# Altium schematic sheet MCUPinout.SchDoc
size B; SheetNumber: 2; SheetTotal: 7
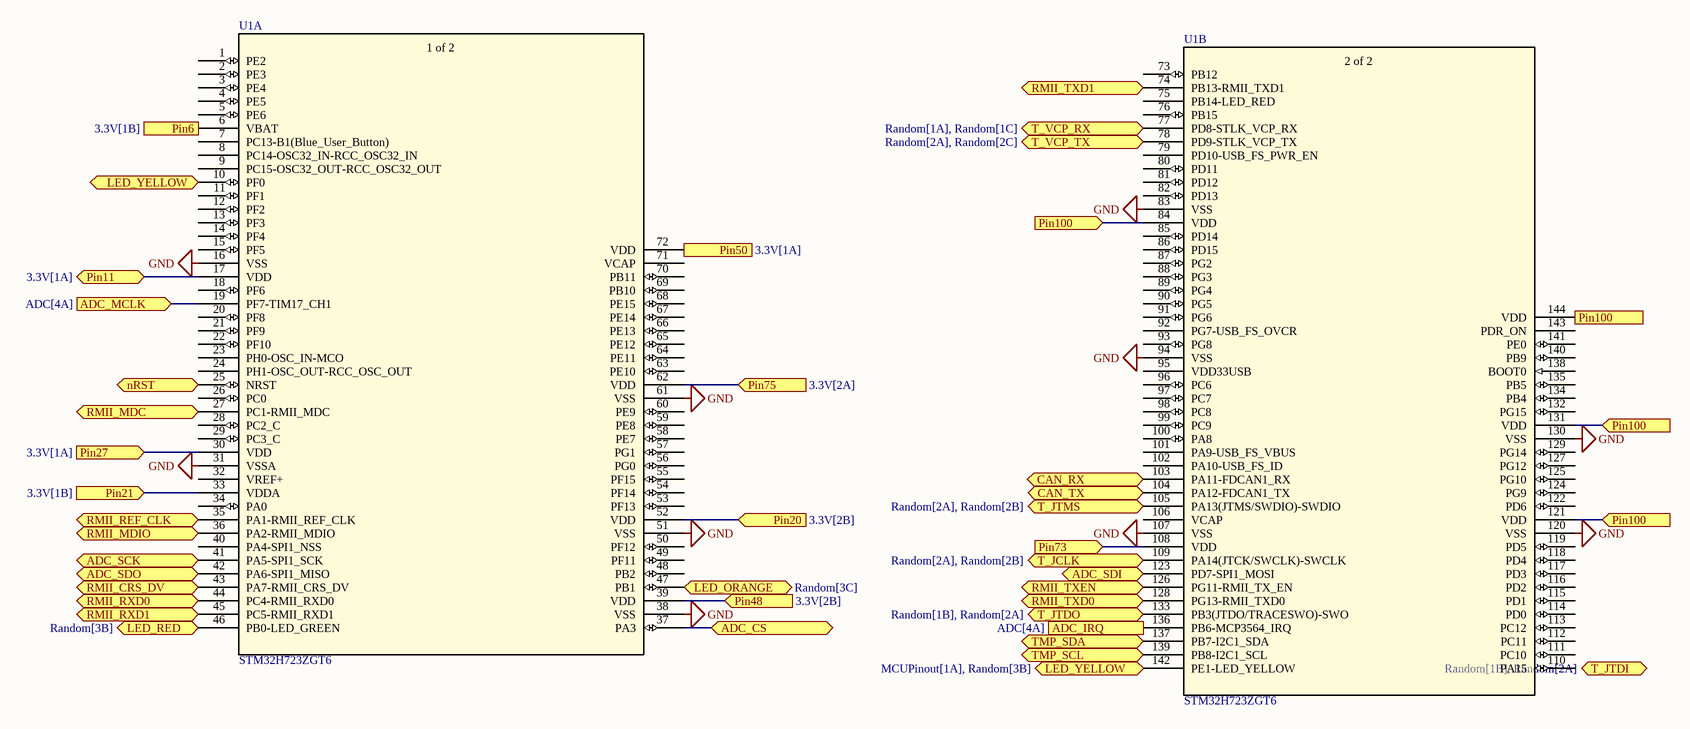
[diagram p0: MCUPinout.SchDoc]

## Parts
U1  STM32H723ZGT6  [LQFP144_STM]  (parts A,B of 2)

## Ports
ADC_CS (bidir, see ADC[4A]), ADC_IRQ (out, see ADC[4A]), ADC_MCLK (in, see ADC[4A]), ADC_SCK (bidir, see ADC[4A]), ADC_SDI (bidir, see ADC[4A]), ADC_SDO (bidir, see ADC[4A]), CAN_RX (bidir, see ADC[3C]), CAN_TX (bidir, see ADC[3C]), LED_ORANGE (bidir, see Random[3C]), LED_RED (bidir, see Random[3B]), LED_YELLOW (bidir, see MCUPinout[1A], Random[3B]), LED_YELLOW (bidir, see MCUPinout[4C], Random[3B]), nRST (bidir, see ETH[1C], Random[2A], Random[2C]), Pin6 (in, see 3.3V[1B]), Pin11 (bidir, see 3.3V[1A]), Pin20 (in, see 3.3V[2B]), Pin21 (in, see 3.3V[1B]), Pin27 (in, see 3.3V[1A]), Pin48 (in, see 3.3V[2B]), Pin50 (in, see 3.3V[1A]), Pin73 (in, see 3.3V[2B]), Pin75 (in, see 3.3V[2A]), Pin100 (in, see 3.3V[2A], MCUPinout[4A], MCUPinout[5B], MCUPinout[6B]), Pin100 (in, see 3.3V[2A], MCUPinout[4A], MCUPinout[6B]), Pin100 (in, see 3.3V[2A], MCUPinout[5B], MCUPinout[6B]), RMII_CRS_DV (bidir, see ETH[1C]), RMII_MDC (bidir, see ETH[1C]), RMII_MDIO (bidir, see ETH[1C]), RMII_REF_CLK (bidir, see ETH[3B]), RMII_RXD0 (bidir, see ETH[1B]), RMII_RXD1 (bidir, see ETH[1B]), RMII_TXD0 (bidir, see ETH[1B]), RMII_TXD1 (bidir, see ETH[1B]), RMII_TXEN (bidir, see ETH[1B]), T_JCLK (bidir, see Random[2A], Random[2B]), T_JTDI (bidir, see Random[1B], Random[2A]), T_JTDO (bidir, see Random[1B], Random[2A]), T_JTMS (bidir, see Random[2A], Random[2B]), T_VCP_RX (bidir, see Random[1A], Random[1C]), T_VCP_TX (bidir, see Random[2A], Random[2C]), TMP_SCL (bidir, see ADC[1D]), TMP_SDA (bidir, see ADC[1D])

## Nets
GND: U1.16(VSS) U1.31(VSSA) U1.38(VSS) U1.51(VSS) U1.61(VSS) U1.83(VSS) U1.94(VSS) U1.107(VSS) U1.120(VSS) U1.130(VSS)
ADC_CS: U1.37(PA3) ; port ADC_CS
ADC_IRQ: U1.136(PB6-MCP3564_IRQ) ; port ADC_IRQ
ADC_MCLK: U1.19(PF7-TIM17_CH1) ; port ADC_MCLK
ADC_SCK: U1.41(PA5-SPI1_SCK) ; port ADC_SCK
ADC_SDI: U1.123(PD7-SPI1_MOSI) ; port ADC_SDI
ADC_SDO: U1.42(PA6-SPI1_MISO) ; port ADC_SDO
CAN_RX: U1.103(PA11-FDCAN1_RX) ; port CAN_RX
CAN_TX: U1.104(PA12-FDCAN1_TX) ; port CAN_TX
LED_ORANGE: U1.47(PB1) ; port LED_ORANGE
LED_RED: U1.46(PB0-LED_GREEN) ; port LED_RED
LED_YELLOW: U1.10(PF0) U1.142(PE1-LED_YELLOW) ; port LED_YELLOW
nRST: U1.25(NRST) ; port nRST
Pin6: U1.6(VBAT) ; port Pin6
Pin11: U1.17(VDD) ; port Pin11
Pin20: U1.52(VDD) ; port Pin20
Pin21: U1.33(VDDA) ; port Pin21
Pin27: U1.30(VDD) ; port Pin27
Pin48: U1.39(VDD) ; port Pin48
Pin50: U1.72(VDD) ; port Pin50
Pin73: U1.108(VDD) ; port Pin73
Pin75: U1.62(VDD) ; port Pin75
Pin100: U1.84(VDD) U1.121(VDD) U1.131(VDD) U1.144(VDD) ; port Pin100
RMII_CRS_DV: U1.43(PA7-RMII_CRS_DV) ; port RMII_CRS_DV
RMII_MDC: U1.27(PC1-RMII_MDC) ; port RMII_MDC
RMII_MDIO: U1.36(PA2-RMII_MDIO) ; port RMII_MDIO
RMII_REF_CLK: U1.35(PA1-RMII_REF_CLK) ; port RMII_REF_CLK
RMII_RXD0: U1.44(PC4-RMII_RXD0) ; port RMII_RXD0
RMII_RXD1: U1.45(PC5-RMII_RXD1) ; port RMII_RXD1
RMII_TXD0: U1.128(PG13-RMII_TXD0) ; port RMII_TXD0
RMII_TXD1: U1.74(PB13-RMII_TXD1) ; port RMII_TXD1
RMII_TXEN: U1.126(PG11-RMII_TX_EN) ; port RMII_TXEN
T_JCLK: U1.109(PA14(JTCK/SWCLK)-SWCLK) ; port T_JCLK
T_JTDO: U1.133(PB3(JTDO/TRACESWO)-SWO) ; port T_JTDO
T_JTMS: U1.105(PA13(JTMS/SWDIO)-SWDIO) ; port T_JTMS
T_VCP_RX: U1.77(PD8-STLK_VCP_RX) ; port T_VCP_RX
T_VCP_TX: U1.78(PD9-STLK_VCP_TX) ; port T_VCP_TX
TMP_SCL: U1.139(PB8-I2C1_SCL) ; port TMP_SCL
TMP_SDA: U1.137(PB7-I2C1_SDA) ; port TMP_SDA

Not connected (* = marked no-connect by the designer): U1 1(PE2) 2(PE3) 3(PE4) 4(PE5) 5(PE6) 7(PC13-B1(Blue_User_Button)) 8(PC14-OSC32_IN-RCC_OSC32_IN) 9(PC15-OSC32_OUT-RCC_OSC32_OUT) 11(PF1) 12(PF2) 13(PF3) 14(PF4) 15(PF5) 18(PF6) 20(PF8) 21(PF9) 22(PF10) 23(PH0-OSC_IN-MCO) 24(PH1-OSC_OUT-RCC_OSC_OUT) 26(PC0) 28(PC2_C) 29(PC3_C) 32(VREF+) 34(PA0) 40(PA4-SPI1_NSS) 48(PB2) 49(PF11) 50(PF12) 53(PF13) 54(PF14) 55(PF15) 56(PG0) 57(PG1) 58(PE7) 59(PE8) 60(PE9) 63(PE10) 64(PE11) 65(PE12) 66(PE13) 67(PE14) 68(PE15) 69(PB10) 70(PB11) 71(VCAP) 73(PB12) 75(PB14-LED_RED) 76(PB15) 79(PD10-USB_FS_PWR_EN) 80(PD11) 81(PD12) 82(PD13) 85(PD14) 86(PD15) 87(PG2) 88(PG3) 89(PG4) 90(PG5) 91(PG6) 92(PG7-USB_FS_OVCR) 93(PG8) 95(VDD33USB) 96(PC6) 97(PC7) 98(PC8) 99(PC9) 100(PA8) 101(PA9-USB_FS_VBUS) 102(PA10-USB_FS_ID) 106(VCAP) 110(PA15) 111(PC10) 112(PC11) 113(PC12) 114(PD0) 115(PD1) 116(PD2) 117(PD3) 118(PD4) 119(PD5) 122(PD6) 124(PG9) 125(PG10) 127(PG12) 129(PG14) 132(PG15) 134(PB4) 135(PB5) 138(BOOT0) 140(PB9) 141(PE0) 143(PDR_ON)

## Notes on the sheet
- (in symbol STM32H723ZGT6, part A) 1 of 2
- (in symbol STM32H723ZGT6, part B) 2 of 2

## Library data of the parts
U1 = STM32H723ZGT6: No Description Available; Mfr_Name: STMicroelectronics; RefDes: RefDes; Type: Type